# Altium schematic sheet 05_BATTERY.SchDoc
size 420 x 297 mm; Author: Войлоков В. М.; CompanyName: ВГТУ РП-233; SheetNumber: 5; SheetTotal: 5; DecimalNumber: ВГТУ.436224.001; Name1: Контроллер; Name2: заряда
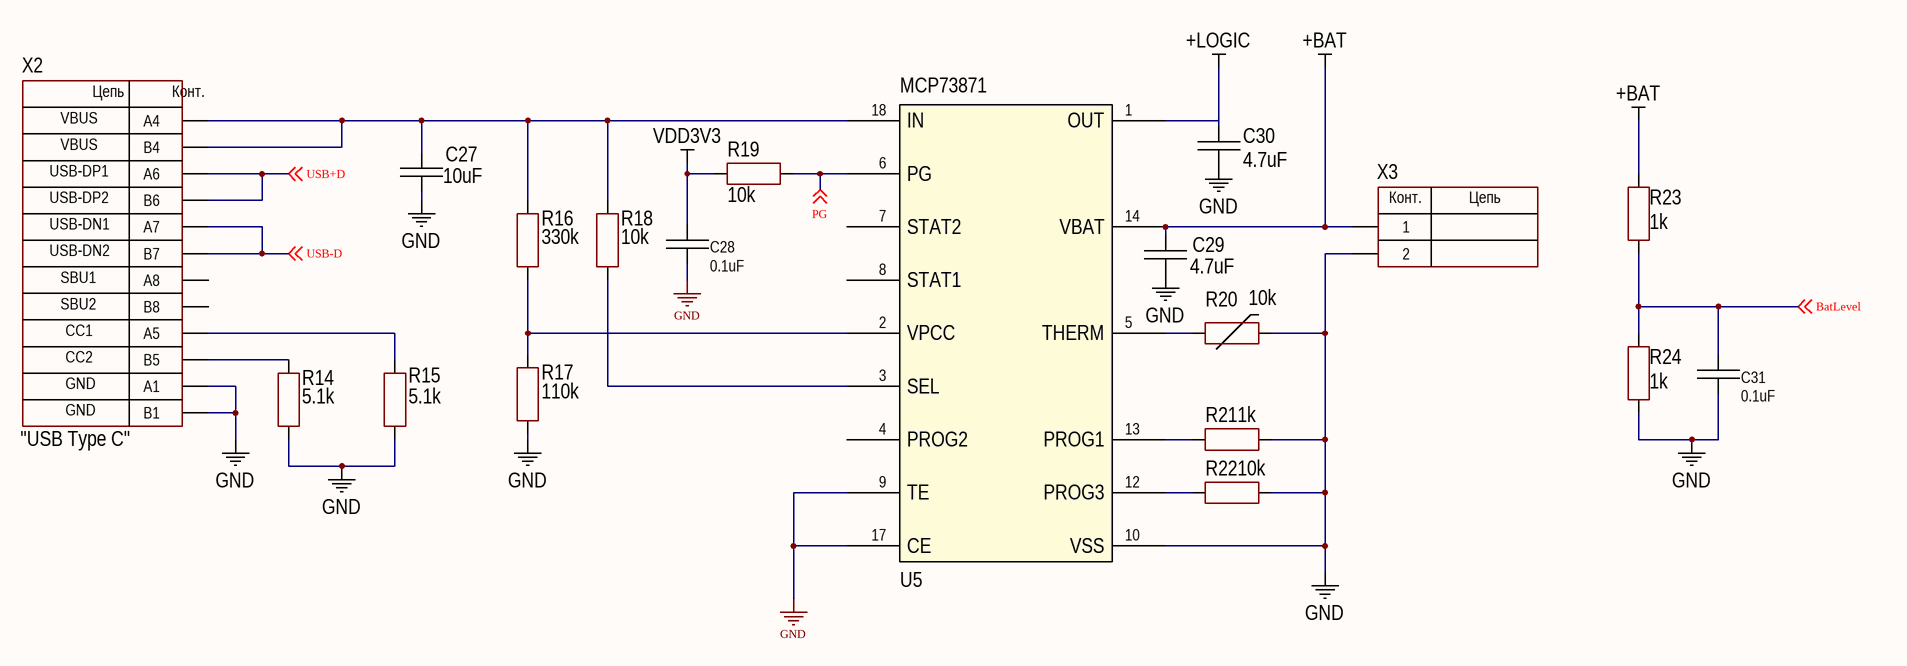
[diagram p0: 05_BATTERY.SchDoc]

## Parts
C27  value 10uF  [CAP: 0805]
C28  value 0.1uF  [CAP: 0603]
C29  value 4.7uF  [CAP: 0805]
C30  value 4.7uF  [CAP: 0805]
C31  value 0.1uF  [CAP: 0603]
R14  value 5.1k  [RES: 0603]
R15  value 5.1k  [RES: 0603]
R16  value 330k  [RES: 0603]
R17  value 110k  [RES: 0603]
R18  value 10k  [RES: 0603]
R19  value 10k  [RES: 0603]
R20  value 10k  [RES: B57237 (NTC)]
R21  value 1k  [RES: 0603]
R22  value 10k  [RES: 0603]
R23  value 1k  [RES: 0603]
R24  value 1k  [RES: 0603]
U5  MCP73871  [20-QFN (4x4)]
X2  CommentText: "USB Type C"  [CON: TYPE-C-31-M-12]
X3  (no value)  [CON: CWF-2R]

## Nets
+BAT: C29.2 R23.1 U5.14(VBAT) X3.1
+LOGIC: C30.2 U5.1(OUT)
GND: C27.1 C28.1 C29.1 C30.1 C31.1 R14.2 R15.2 R17.1 R20.2 R21.2 R22.2 R24.2 U5.9(TE) U5.10(VSS) U5.17(CE) X2.A1 X2.B1 X3.2
VDD3V3: C28.2 R19.2
BatLevel: C31.2 R23.2 R24.1 ; off-sheet BatLevel
PG: R19.1 U5.6(PG) ; off-sheet PG
USB+D: X2.A6 X2.B6 ; off-sheet USB+D
USB-D: X2.A7 X2.B7 ; off-sheet USB-D
NetC27_2: C27.2 R16.2 R18.2 U5.18(IN) X2.A4 X2.B4
NetR14_1: R14.1 X2.B5
NetR15_1: R15.1 X2.A5
NetR16_1: R16.1 R17.2 U5.2(VPCC)
NetR18_1: R18.1 U5.3(SEL)
NetR20_1: R20.1 U5.5(THERM)
NetR21_1: R21.1 U5.13(PROG1)
NetR22_1: R22.1 U5.12(PROG3)

Not connected (* = marked no-connect by the designer): U5 4(PROG2) 7(STAT2) 8(STAT1); X2 A8 B8

## Notes on the sheet
- Перв.примен.
- Справ.№
- Подп. и дата
- Инв.№ дубл.
- Взам.инв.№
- Подп.и дата
- Разраб.
- Изм.
- Лист
- № докум.
- Подп.
- Дата
- Лит.
- Масштаб
- Масса
- Т.контр.
- Пров.
- СХЕМА   ЭЛЕКТРИЧЕСКАЯ
- ПРИНЦИПИАЛЬНАЯ
- Листов
- Инв.№ подл.
- Утв.
- Н.контр.
- Нач.сект.
- Формат  A3
- (in symbol Connector_USB_Type_C) Цепь; Конт.; VBUS; USB-DP1; USB-DP2; USB-DN1; USB-DN2; SBU1; SBU2; CC1; CC2; GND
- (in symbol CWF-2) Конт.; Цепь

## Library data of the parts
C27 = Ceramic_0805: Manufacturer: Yageo; PartNumber: CC0805KRX7R7BB104; ValueManufacturerPartNumber: Ceramic capacitor, 10uF, X7R, ±10%, 16V, 0805, -55...+125°C; TypeCapacitor: Ceramic capacitor; Tolerance: ±10%; TypeDielectric: X7R; Voltage: 16V; Package: 0805; HelpURL: https://www.digikey.com/product-detail/en/yageo/CC0805KRX7R7BB104/311-1142-1-ND/303052; Temperature: -55...+125°C
C28 C31 = Ceramic_0603: Manufacturer: Yageo; PartNumber: CC0603KRX7R7BB104; ValueManufacturerPartNumber: Ceramic capacitor, 0.1uF, X7R, ±10%, 16V, 0603, -55...+125°C; TypeCapacitor: Ceramic capacitor; Tolerance: ±10%; TypeDielectric: X7R; Voltage: 16V; Package: 0603; HelpURL: https://www.digikey.com/product-detail/en/yageo/CC0603KRX7R7BB104/311-1088-1-ND/302998; Temperature: -55...+125°C
C29 C30 = Ceramic_0805: Manufacturer: Yageo; PartNumber: CC0805KRX7R7BB104; ValueManufacturerPartNumber: Ceramic capacitor, 4.7uF, X7R, ±10%, 16V, 0805, -55...+125°C; TypeCapacitor: Ceramic capacitor; Tolerance: ±10%; TypeDielectric: X7R; Voltage: 16V; Package: 0805; HelpURL: https://www.digikey.com/product-detail/en/yageo/CC0805KRX7R7BB104/311-1142-1-ND/303052; Temperature: -55...+125°C
R14 R15 = Resistor_0603: Manufacturer: Yageo; PartNumber: RC0603JR-07100RL; ValueManufacturerPartNumber: Resistor film, 5.1k, ±1%, 0603, 0.1W, -55...+125°C; TypeResistor: Resistor film; Power: 0.1W; Tolerance: ±1%; Package: 0603; HelpURL: https://www.digikey.com/product-detail/en/yageo/RC0603JR-07100RL/311-100GRCT-ND/729644; Temperature: -55...+125°C
R16 = Resistor_0603: Manufacturer: Yageo; PartNumber: RC0603JR-07100RL; ValueManufacturerPartNumber: Resistor film, 330k, ±1%, 0603, 0.1W, -55...+125°C; TypeResistor: Resistor film; Power: 0.1W; Tolerance: ±1%; Package: 0603; HelpURL: https://www.digikey.com/product-detail/en/yageo/RC0603JR-07100RL/311-100GRCT-ND/729644; Temperature: -55...+125°C
R17 = Resistor_0603: Manufacturer: Yageo; PartNumber: RC0603JR-07100RL; ValueManufacturerPartNumber: Resistor film, 110k, ±1%, 0603, 0.1W, -55...+125°C; TypeResistor: Resistor film; Power: 0.1W; Tolerance: ±1%; Package: 0603; HelpURL: https://www.digikey.com/product-detail/en/yageo/RC0603JR-07100RL/311-100GRCT-ND/729644; Temperature: -55...+125°C
R18 R19 R22 = Resistor_0603: Manufacturer: Yageo; PartNumber: RC0603JR-07100RL; ValueManufacturerPartNumber: Resistor film, 10k, ±1%, 0603, 0.1W, -55...+125°C; TypeResistor: Resistor film; Power: 0.1W; Tolerance: ±1%; Package: 0603; HelpURL: https://www.digikey.com/product-detail/en/yageo/RC0603JR-07100RL/311-100GRCT-ND/729644; Temperature: -55...+125°C
R20 = NTC: Manufacturer: Epcos; PartNumber: B57237S229M54; ValueManufacturerPartNumber: NTC resistor, 10k, ±5%, pitch 7.5mm, 7A, -55...+125°C; TypeResistor: NTC resistor; MaxCurrent: 7A; Tolerance: ±5%; Package: pitch 7.5mm; HelpURL: https://www.digikey.com/product-detail/en/epcos-tdk/B57237S229M54/495-76635-1-ND/8126375; Temperature: -55...+125°C
R21 R23 R24 = Resistor_0603: Manufacturer: Yageo; PartNumber: RC0603JR-07100RL; ValueManufacturerPartNumber: Resistor film, 1k, ±1%, 0603, 0.1W, -55...+125°C; TypeResistor: Resistor film; Power: 0.1W; Tolerance: ±1%; Package: 0603; HelpURL: https://www.digikey.com/product-detail/en/yageo/RC0603JR-07100RL/311-100GRCT-ND/729644; Temperature: -55...+125°C
U5 = BQ24074RGTT: pin to pad: 1>1+20 10>10+11 14>14+15+16 18>18+19
X2 = Connector_USB_Type_C: Manufacturer: Korean Hroparts; ValueManufacturerPartNumber: USB Type C, 3A; PartNumber: TYPE-C-31-M-12; TypeConnector: USB Type C; CurrentMax: 3A; HelpURL: https://lcsc.com/product-detail/USB-Type-C_Korean-Hroparts-Elec-TYPE-C-31-M-12_C165948.html
X3 = CWF-2: Manufacturer: Connfly; ValueManufacturerPartNumber: Connector, 2pin, 2.54mm, 250VAC, 3A; PartNumber: CWF-2R; TypeConnector: Connector; VoltageMax: 250VAC; Pitch: 2.54mm; CurrentMax: 3A; Multichannel: 2pin; CommentText: "Разъем"; HelpURL: https://www.chipdip.ru/product/cwf-2r-ds1069-2-mr